# Altium schematic sheet I2C ADC shield.SchDoc
size A3; SheetNumber: 3; SheetTotal: 3
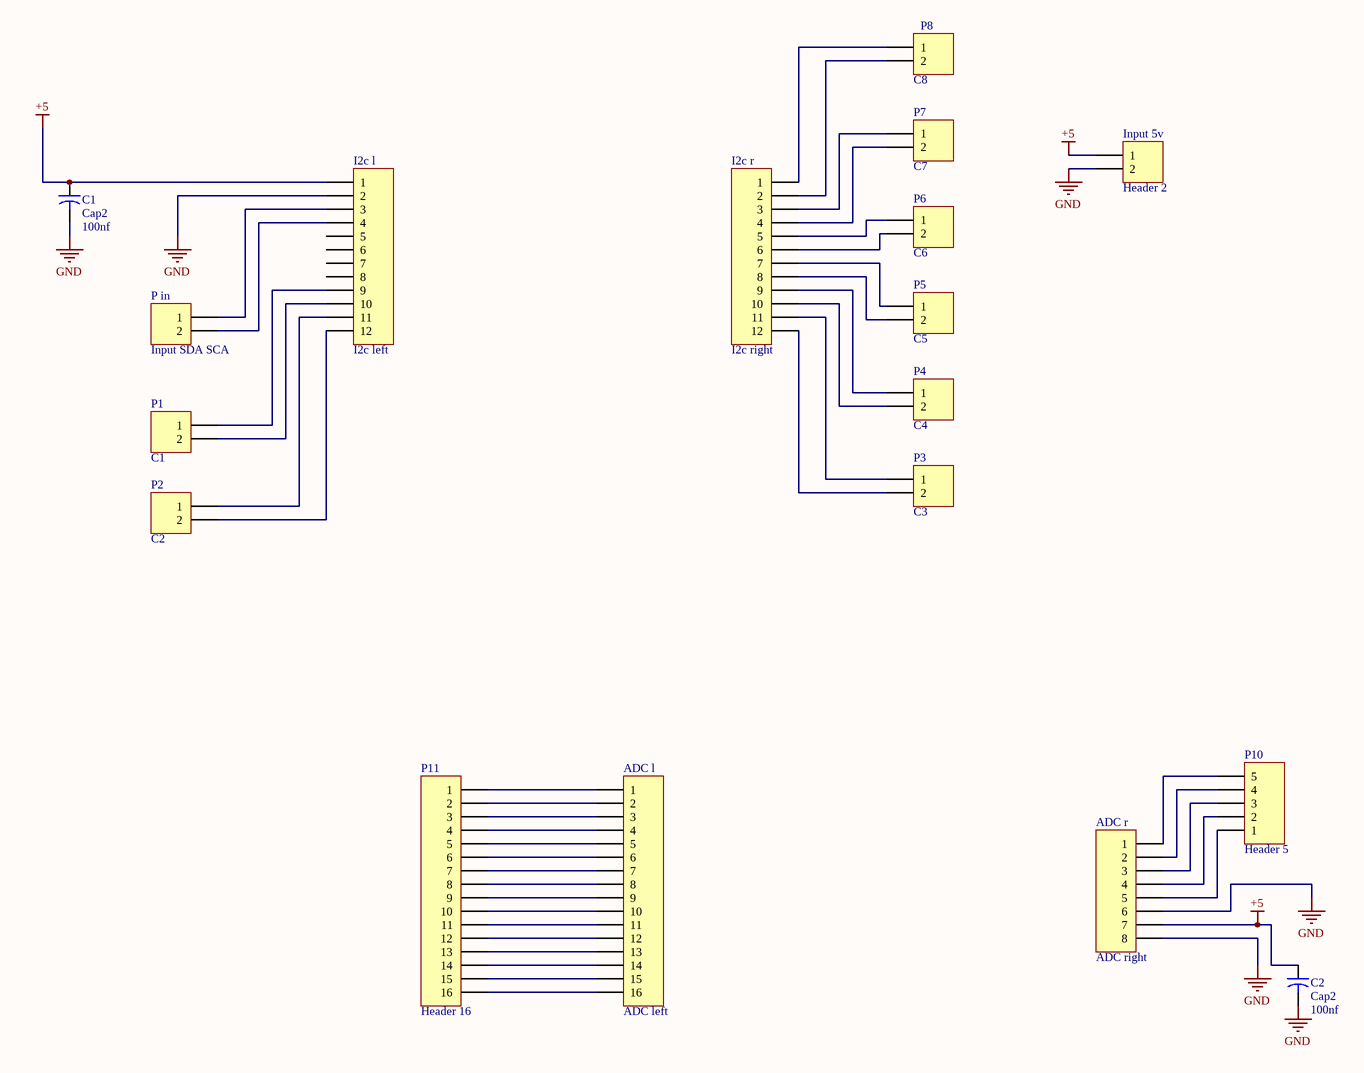
[diagram p0: I2C ADC shield.SchDoc]

## Parts
ADC_l  ADC left  [HDR1X16]
ADC_r  ADC right  [HDR1X8]
C1  Cap2  value 100nf  [CAPR5-4X5]
C2  Cap2  value 100nf  [CAPR5-4X5]
I2c_l  I2c left  [HDR1X12]
I2c_r  I2c right  [HDR1X12]
Input_5v  Header 2  [HDR1X2]
P1  C1  [HDR1X2]
P2  C2  [HDR1X2]
P3  C3  [HDR1X2]
P4  C4  [HDR1X2]
P5  C5  [HDR1X2]
P6  C6  [HDR1X2]
P7  C7  [HDR1X2]
P8  C8  [HDR1X2]
P10  Header 5  [HDR1X5]
P11  Header 16  [HDR1X16]
P_in  Input SDA SCA  [HDR1X2]

## Nets
+5: ADC_r.7 C1.1 C2.1 I2c_l.1 Input_5v.1
GND: ADC_r.6 ADC_r.8 C1.2 C2.2 I2c_l.2 Input_5v.2
NetADC_l_1: ADC_l.1 P11.1
NetADC_l_2: ADC_l.2 P11.2
NetADC_l_3: ADC_l.3 P11.3
NetADC_l_4: ADC_l.4 P11.4
NetADC_l_5: ADC_l.5 P11.5
NetADC_l_6: ADC_l.6 P11.6
NetADC_l_7: ADC_l.7 P11.7
NetADC_l_8: ADC_l.8 P11.8
NetADC_l_9: ADC_l.9 P11.9
NetADC_l_10: ADC_l.10 P11.10
NetADC_l_11: ADC_l.11 P11.11
NetADC_l_12: ADC_l.12 P11.12
NetADC_l_13: ADC_l.13 P11.13
NetADC_l_14: ADC_l.14 P11.14
NetADC_l_15: ADC_l.15 P11.15
NetADC_l_16: ADC_l.16 P11.16
NetADC_r_1: ADC_r.1 P10.5
NetADC_r_2: ADC_r.2 P10.4
NetADC_r_3: ADC_r.3 P10.3
NetADC_r_4: ADC_r.4 P10.2
NetADC_r_5: ADC_r.5 P10.1
NetI2c_l_3: I2c_l.3 P_in.1
NetI2c_l_4: I2c_l.4 P_in.2
NetI2c_l_9: I2c_l.9 P1.1
NetI2c_l_10: I2c_l.10 P1.2
NetI2c_l_11: I2c_l.11 P2.1
NetI2c_l_12: I2c_l.12 P2.2
NetI2c_r_1: I2c_r.1 P8.1
NetI2c_r_2: I2c_r.2 P8.2
NetI2c_r_3: I2c_r.3 P7.1
NetI2c_r_4: I2c_r.4 P7.2
NetI2c_r_5: I2c_r.5 P6.1
NetI2c_r_6: I2c_r.6 P6.2
NetI2c_r_7: I2c_r.7 P5.1
NetI2c_r_8: I2c_r.8 P5.2
NetI2c_r_9: I2c_r.9 P4.1
NetI2c_r_10: I2c_r.10 P4.2
NetI2c_r_11: I2c_r.11 P3.1
NetI2c_r_12: I2c_r.12 P3.2

Not connected (* = marked no-connect by the designer): I2c_l 5 6 7 8

## Library data of the parts
ADC_l P11 = Header 16: Header, 16-Pin; LatestRevisionDate: 17-Jul-2002; LatestRevisionNote: Re-released for DXP Platform.; Publisher: Altium Limited
ADC_r = Header 8: Header, 8-Pin; LatestRevisionDate: 17-Jul-2002; LatestRevisionNote: Re-released for DXP Platform.; Publisher: Altium Limited
C1 C2 = Cap2: Capacitor; Published: 23-Sep-2002; PackageReference: CAPR5-4X5; Publisher: Altium Limited; PackageDescription: Capacitor; 2 Leads
I2c_l I2c_r = Header 12: Header, 12-Pin; LatestRevisionDate: 17-Jul-2002; LatestRevisionNote: Re-released for DXP Platform.; Publisher: Altium Limited
Input_5v P1-P8 P_in = Header 2: Header, 2-Pin; LatestRevisionDate: 17-Jul-2002; LatestRevisionNote: Re-released for DXP Platform.; Publisher: Altium Limited
P10 = Header 5: Header, 5-Pin; LatestRevisionDate: 17-Jul-2002; LatestRevisionNote: Re-released for DXP Platform.; Publisher: Altium Limited